# EAGLE design base (EAGLE 9.2.2)
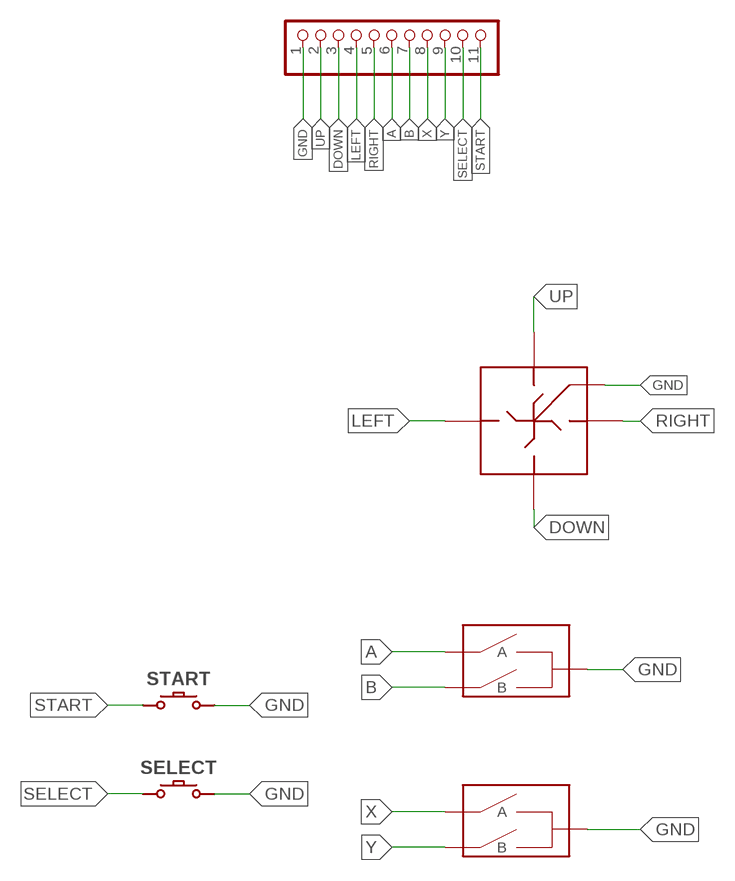
[diagram p0: schematic, sheet 1]

## Parts
GND  PINHD-1X11_2.54  [1X11]
S1  D-PAD  [D-PAD]
S2  XY_BUTTON  AB_BUTTON  [AB_BUTTON]
S3  AB_BUTTON  [AB_BUTTON]
SELECT  CONDUCTIVE_BUTTON_STARTSELECTCONDUCTIVE_BUTTON_THICK_STARTSELECT  [CONDUCTIVE_BUTTON_THICK_STARTSELECT]
START  CONDUCTIVE_BUTTON_STARTSELECTCONDUCTIVE_BUTTON_THICK_STARTSELECT  [CONDUCTIVE_BUTTON_THICK_STARTSELECT]

## Nets
A: GND.6 S3.A@1(A) S3.A@2(A)
B: GND.7 S3.B@1(B) S3.B@2(B)
DOWN: GND.3 S1.LEFT
GND: GND.1 S1.GND@1(GND) S1.GND@2(GND) S1.GND@3(GND) S1.GND@4(GND) S2.GND@1(GND) S2.GND@2(GND) S2.GND@3(GND) S2.GND@4(GND) S3.GND@1(GND) S3.GND@2(GND) S3.GND@3(GND) S3.GND@4(GND) SELECT.P$ACTIVE SELECT.P$ACTIVE1(P$ACTIVE) SELECT.P$ACTIVE2(P$ACTIVE) SELECT.P$ACTIVE3(P$ACTIVE) START.P$ACTIVE START.P$ACTIVE1(P$ACTIVE) START.P$ACTIVE2(P$ACTIVE) START.P$ACTIVE3(P$ACTIVE)
LEFT: GND.4 S1.UP
RIGHT: GND.5 S1.DOWN
SELECT: GND.10 SELECT.P$GND SELECT.P$GND1(P$GND) SELECT.P$GND2(P$GND) SELECT.P$GND3(P$GND)
START: GND.11 START.P$GND START.P$GND1(P$GND) START.P$GND2(P$GND) START.P$GND3(P$GND)
UP: GND.2 S1.RIGHT
X: GND.8 S2.A@1(A) S2.A@2(A)
Y: GND.9 S2.B@1(B) S2.B@2(B)

## Library data of the parts
GND = pinhead + SMD:PINHD-1X11: PIN HEADER
S1 = GBP AIO:D-PAD
S2 S3 = GBP AIO:AB_BUTTON
SELECT START = 32teeth - Conductive Buttons v2:CONDUCTIVE_BUTTON_STARTSELECT

## Board
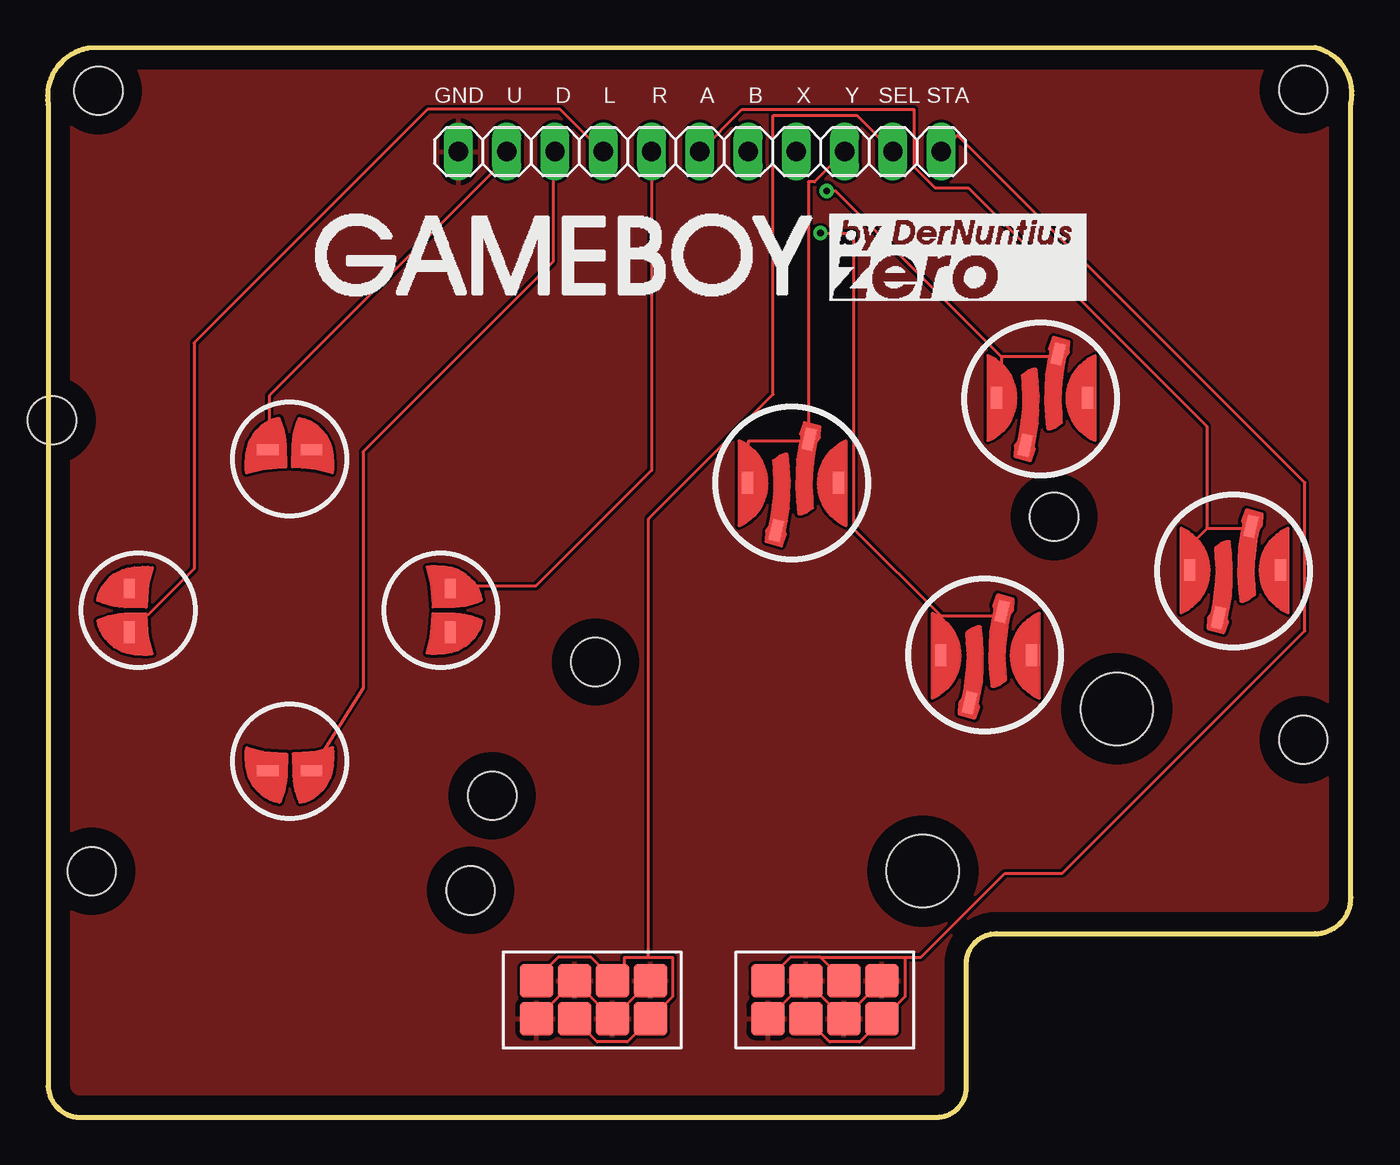
[diagram p1: board, top side]
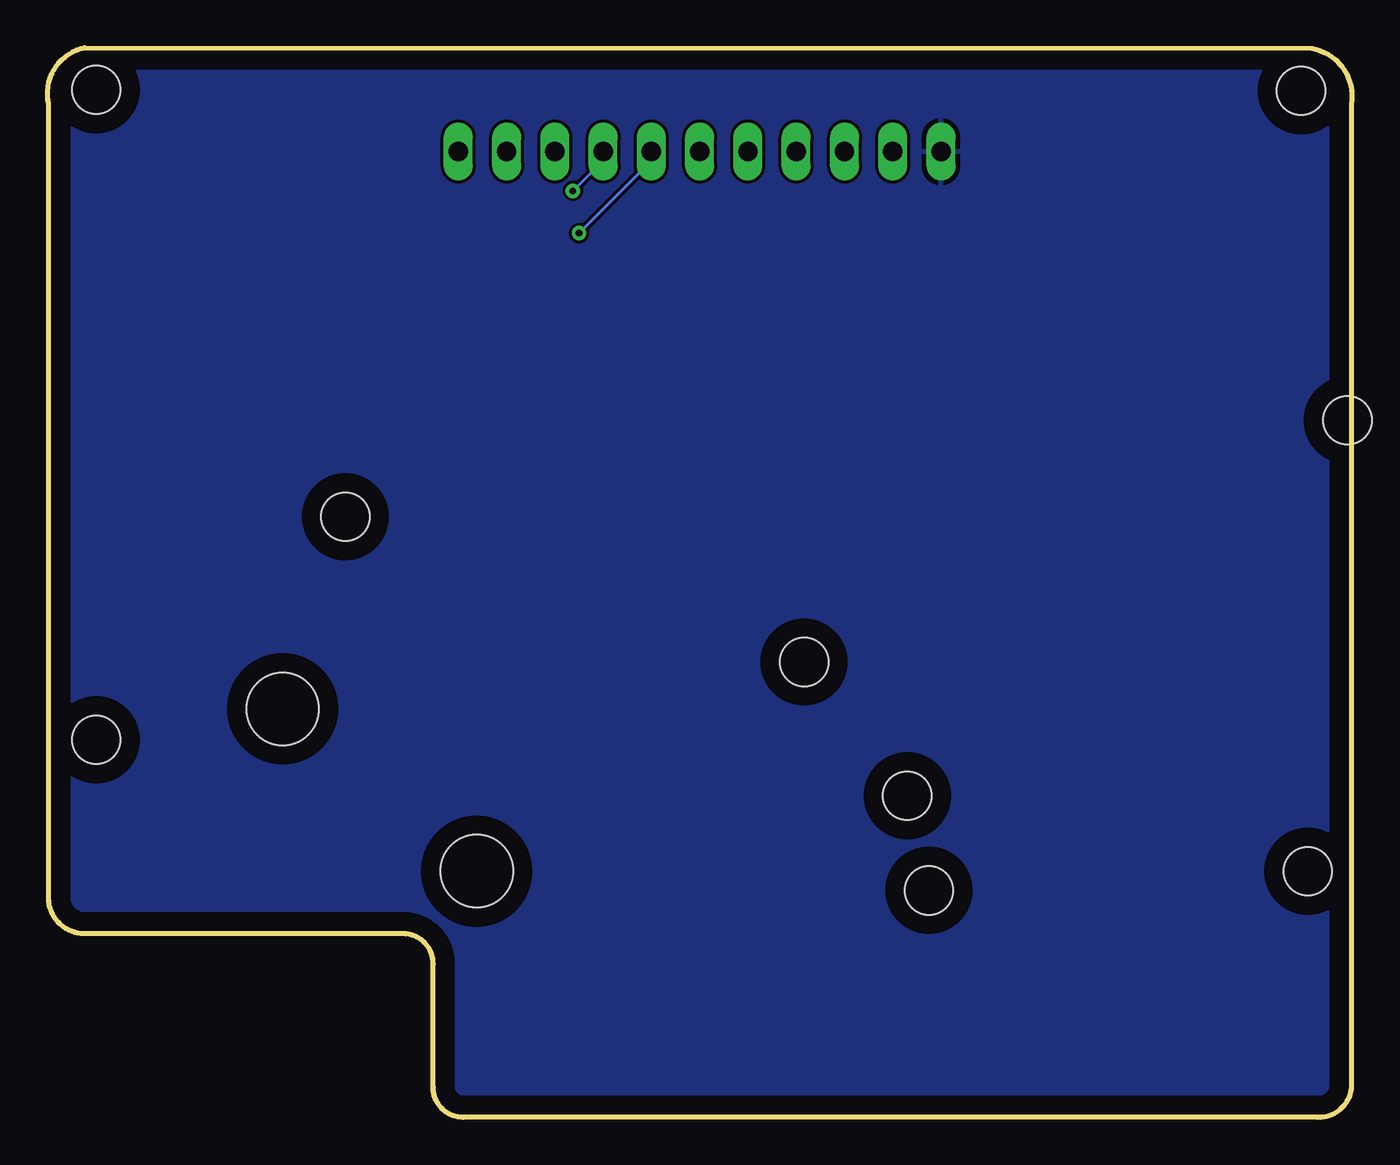
[diagram p2: board, bottom side, seen from below]

Size 68.64 x 56.28 mm. Coordinates in mm from the lower left corner, seen from the top.
Outline: 66.7,56.28 2.11,56.23 arc90 0.04,53.29 0.04,1.63 arc90 1.81,0 46.77,0 arc90 48.35,1.58 48.35,8.08 arc-90 49.93,9.66 66.7,9.66 arc90 68.59,11.55 68.59,53.32 arc90 66.7,56.28
Copper layers (1*16): Top 0.035mm / dielectric 1.5mm / Bottom 0.035mm
Design rules "default": minimum track width 6mil, minimum drill 0.35mm, track to track 6mil, track to pad 6mil, pad to pad 6mil, via to via 6mil, smd to smd 6mil, copper to edge 40mil, drill to drill 6mil, minimum pad ring 10mil, minimum via ring 8mil, stop-mask expansion 4mil, vias tented up to drill 0mil, thermal gap 10mil
Holes 2.54 mm at 22.26,11.94 2.32,12.95 23.4,16.92 66.08,19.86 52.97,31.6 2.68,54 66.08,54.05 28.83,23.95 0.24,36.68
Holes 3.81 mm at 46.06,12.95 56.27,21.49

### Footprints (pad centres in the part's own frame; a part is rotated, then mirrored left to right if it is on the bottom)
1X11 = drill 1.016 long: 1 -12.7,0; 2 -10.16,0; 3 -7.62,0; 4 -5.08,0; 5 -2.54,0; 6 0,0; 7 2.54,0; 8 5.08,0; 9 7.62,0; 10 10.16,0; 11 12.7,0
D-PAD = smd 1.039 x 0.574: DOWN 1.149,-8.444; GND@1 1.149,8.444 | smd 0.574 x 1.149: GND@2 -8.444,1.149; GND@4 8.444,-1.149; LEFT -8.444,-1.149; RIGHT 8.444,1.149 | smd 1.149 x 0.574: GND@3 -1.149,-8.444; UP -1.149,8.444
AB_BUTTON = smd 0.574 x 1.149: A@1 4.182,2.298; B@1 -8.915,-2.183; GND@2 -4.136,-2.183; GND@4 8.961,2.298 | smd 1.149 x 0.574 rotated 77: A@2 7.422,4.595; B@2 -5.675,0.115; GND@1 -7.399,-4.687; GND@3 5.698,-0.207
CONDUCTIVE_BUTTON_THICK_STARTSELECT = smd 1.75 x 1.75: P$ACTIVE 3,1; P$ACTIVE1 -1,1; P$ACTIVE2 -3,-1; P$ACTIVE3 1,-1; P$GND 1,1; P$GND1 -3,1; P$GND2 -1,-1; P$GND3 3,-1

### Placement (x,y rotation side)
GND  34.33,50.8 0 top
S1  12.74,26.67 90 top
S2  45.76,35.56 0 top
S3  55.92,26.49 0 top
SELECT  28.74,6.2 0 top
START  40.91,6.2 0 top

### Tracks (layer width: path | path; a pad name or v marks a point on that pad's centre or on a via)
A
  Top 0.152: 61,30.96 63.22,30.96 S3.A@2 | 61,30.96 61,36.35 48.46,48.89 46.71,48.89 45.6,50.01 45.6,53.02 36.55,53.02 GND.6 | 61,30.96 60.1,30.06 S3.A@1
B  (via drill 0.35)
  Top 0.152: 47.03,26.35 47.03,24.45 S3.B@1 | 47.03,26.35 50.2,26.35 S3.B@2 | 47.03,26.35 42.42,30.96 42.42,46.51 v40.68,46.51
  Bottom 0.152: v40.68,46.51 36.87,50.32 GND.7
DOWN
  Top 0.152: S1.LEFT 16.6,22.58 16.6,35 26.6,45.01 26.6,50.8 GND.3
GND
  Top 0.152: START.P$ACTIVE 43.89,7.16 43.87,7.16 START.P$ACTIVE3 41.97,5.22 41.88,5.22 START.P$ACTIVE1 START.P$ACTIVE2 | SELECT.P$ACTIVE SELECT.P$ACTIVE3 27.9,7.04 SELECT.P$ACTIVE1 SELECT.P$ACTIVE2
  pour Bottom: 76.24,114.3 76.24,-17.78 -5.04,-17.78 -5.04,111.76 -3.77,113.03 74.97,113.03
  pour Top: -5.45,109.63 -5.45,-19.05 74.97,-19.05 74.97,109.12 -4.94,109.12
LEFT
  Top 0.152: S1.UP 4.35,25.65 5.12,26.42 5.27,26.42 7.71,28.85 7.71,40.74 20,53.03 26.96,53.03 29.2,50.8 GND.4
RIGHT
  Top 0.152: GND.5 31.79,34.04 25.69,27.94 21.27,27.94 S1.DOWN
SELECT
  Top 0.152: SELECT.P$GND2 27.82,5.08 28.93,3.97 30.52,3.97 31.63,5.08 SELECT.P$GND3 31.79,5.24 32.9,6.35 32.9,8.41 31.63,8.41 | SELECT.P$GND1 25.75,7.3 26.87,8.41 28.61,8.41 29.72,7.3 SELECT.P$GND 29.88,7.3 30.36,7.3 30.36,8.41 31.63,8.41 | GND.10 42.58,52.7 38.18,52.7 38.18,38.04 31.63,31.48 31.63,8.41
START
  Top 0.152: START.P$GND2 40.04,5.08 41.15,3.97 42.74,3.97 43.85,5.08 START.P$GND3 44.01,5.24 45.12,6.35 45.12,8.41 | 40.68,8.41 39.09,8.41 37.98,7.3 START.P$GND1 | 40.68,8.41 41.79,7.3 START.P$GND | 40.68,8.41 45.12,8.41 | 45.12,8.41 45.96,8.41 50.38,12.83 53.4,12.83 66.17,25.6 66.17,33.39 47.89,51.66 GND.11
UP
  Top 0.152: S1.RIGHT 11.67,35.25 11.67,37.95 24.17,50.44 GND.2
X  (via drill 0.35)
  Top 0.152: 50.2,40 50.2,38.1 S2.A@1 | 50.2,40 53.06,40 S2.A@2 | 50.2,40 41.47,48.74 v40.99,48.74
  Bottom 0.152: v40.99,48.74 39.41,50.32 GND.8
Y
  Top 0.152: S2.B@1 36.87,33.66 36.87,35.56 40.04,35.56 S2.B@2 40.04,35.72 40.04,49.21 40.36,49.21 GND.9

### Text on the board
tNames: GND | U | D | L | R | A | B | X | Y | SEL | STA